# Altium schematic sheet DAQ.SchDoc
size A3
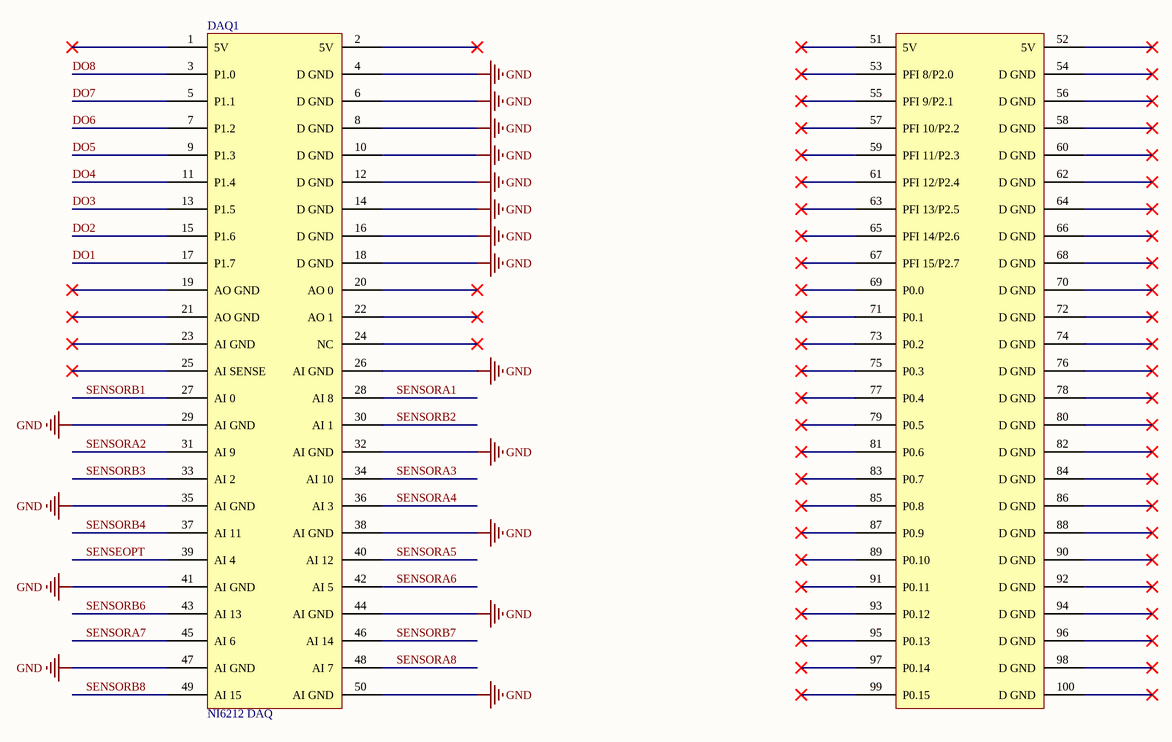
[diagram p0: DAQ.SchDoc]

## Parts
DAQ1  NI6212 DAQ  [NIDAQ6212]

## Nets
GND: DAQ1.4(D_GND) DAQ1.6(D_GND) DAQ1.8(D_GND) DAQ1.10(D_GND) DAQ1.12(D_GND) DAQ1.14(D_GND) DAQ1.16(D_GND) DAQ1.18(D_GND) DAQ1.26(AI_GND) DAQ1.29(AI_GND) DAQ1.32(AI_GND) DAQ1.35(AI_GND) DAQ1.38(AI_GND) DAQ1.41(AI_GND) DAQ1.44(AI_GND) DAQ1.47(AI_GND) DAQ1.50(AI_GND)
DO1: DAQ1.17(P1.7)
DO2: DAQ1.15(P1.6)
DO3: DAQ1.13(P1.5)
DO4: DAQ1.11(P1.4)
DO5: DAQ1.9(P1.3)
DO6: DAQ1.7(P1.2)
DO7: DAQ1.5(P1.1)
DO8: DAQ1.3(P1.0)
SENSEOPT: DAQ1.39(AI_4)
SENSORA1: DAQ1.28(AI_8)
SENSORA2: DAQ1.31(AI_9)
SENSORA3: DAQ1.34(AI_10)
SENSORA4: DAQ1.36(AI_3)
SENSORA5: DAQ1.40(AI_12)
SENSORA6: DAQ1.42(AI_5)
SENSORA7: DAQ1.45(AI_6)
SENSORA8: DAQ1.48(AI_7)
SENSORB1: DAQ1.27(AI_0)
SENSORB2: DAQ1.30(AI_1)
SENSORB3: DAQ1.33(AI_2)
SENSORB4: DAQ1.37(AI_11)
SENSORB6: DAQ1.43(AI_13)
SENSORB7: DAQ1.46(AI_14)
SENSORB8: DAQ1.49(AI_15)

Not connected (* = marked no-connect by the designer): DAQ1 1(5V)* 2(5V)* 19(AO_GND)* 20(AO_0)* 21(AO_GND)* 22(AO_1)* 23(AI_GND)* 24(NC)* 25(AI_SENSE)* 51(5V)* 52(5V)* 53(PFI_8/P2.0)* 54(D_GND)* 55(PFI_9/P2.1)* 56(D_GND)* 57(PFI_10/P2.2)* 58(D_GND)* 59(PFI_11/P2.3)* 60(D_GND)* 61(PFI_12/P2.4)* 62(D_GND)* 63(PFI_13/P2.5)* 64(D_GND)* 65(PFI_14/P2.6)* 66(D_GND)* 67(PFI_15/P2.7)* 68(D_GND)* 69(P0.0)* 70(D_GND)* 71(P0.1)* 72(D_GND)* 73(P0.2)* 74(D_GND)* 75(P0.3)* 76(D_GND)* 77(P0.4)* 78(D_GND)* 79(P0.5)* 80(D_GND)* 81(P0.6)* 82(D_GND)* 83(P0.7)* 84(D_GND)* 85(P0.8)* 86(D_GND)* 87(P0.9)* 88(D_GND)* 89(P0.10)* 90(D_GND)* 91(P0.11)* 92(D_GND)* 93(P0.12)* 94(D_GND)* 95(P0.13)* 96(D_GND)* 97(P0.14)* 98(D_GND)* 99(P0.15)* 100(D_GND)*

## Library data of the parts
DAQ1 = NI6212: DAQ Unit; Published: 8-Jun-2000; Publisher: National Instruments